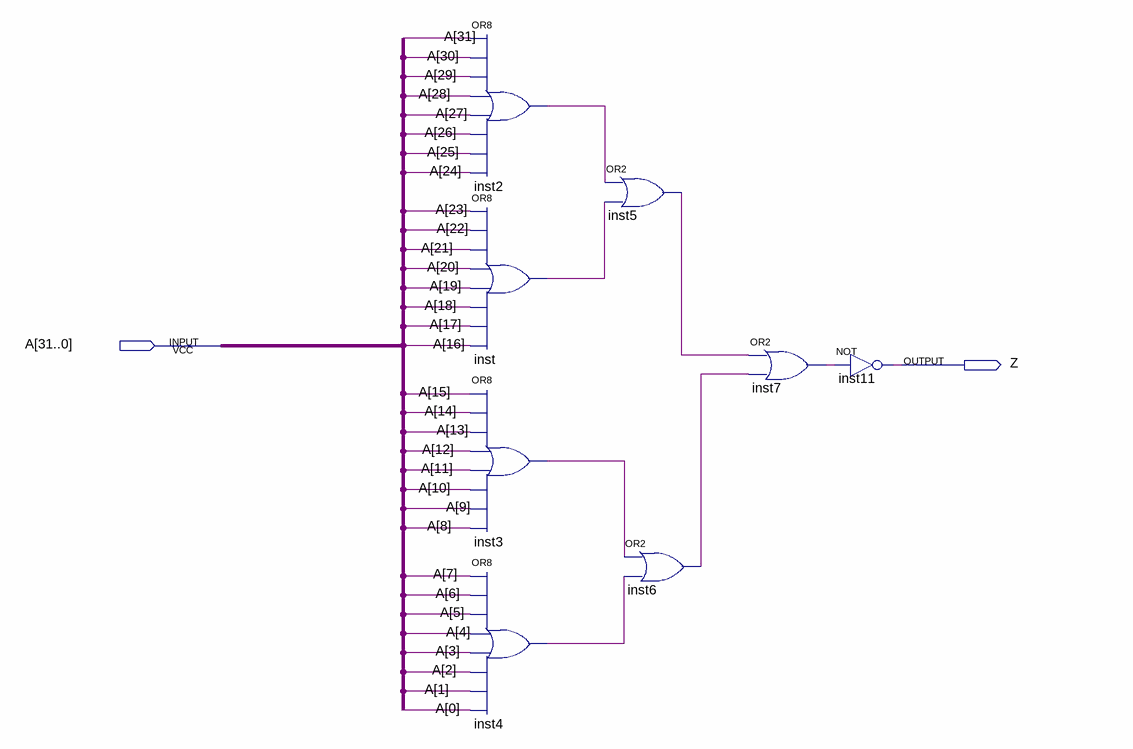
[diagram p0: schematic sheet]
// Quartus schematic zeroDectector32Bit.bdf as structural Verilog: 8 symbols, 2 pins
module zeroDectector32Bit (
  input  [31:0] A,
  output Z
);

  wire inst2_out, inst3_out, inst4_out, inst5_out, inst6_out, inst7_out, inst_out;

  or inst2 (inst2_out, A[31], A[30], A[29], A[28], A[27], A[26], A[25], A[24]);
  or inst (inst_out, A[23], A[22], A[21], A[20], A[19], A[18], A[17], A[16]);
  or inst3 (inst3_out, A[15], A[14], A[13], A[12], A[11], A[10], A[9], A[8]);
  or inst4 (inst4_out, A[7], A[6], A[5], A[4], A[3], A[2], A[1], A[0]);
  or inst5 (inst5_out, inst2_out, inst_out);
  or inst6 (inst6_out, inst3_out, inst4_out);
  or inst7 (inst7_out, inst5_out, inst6_out);
  not inst11 (Z, inst7_out);
endmodule
